# EAGLE design Ethernet_Breakout-Board (EAGLE 9.7.0)
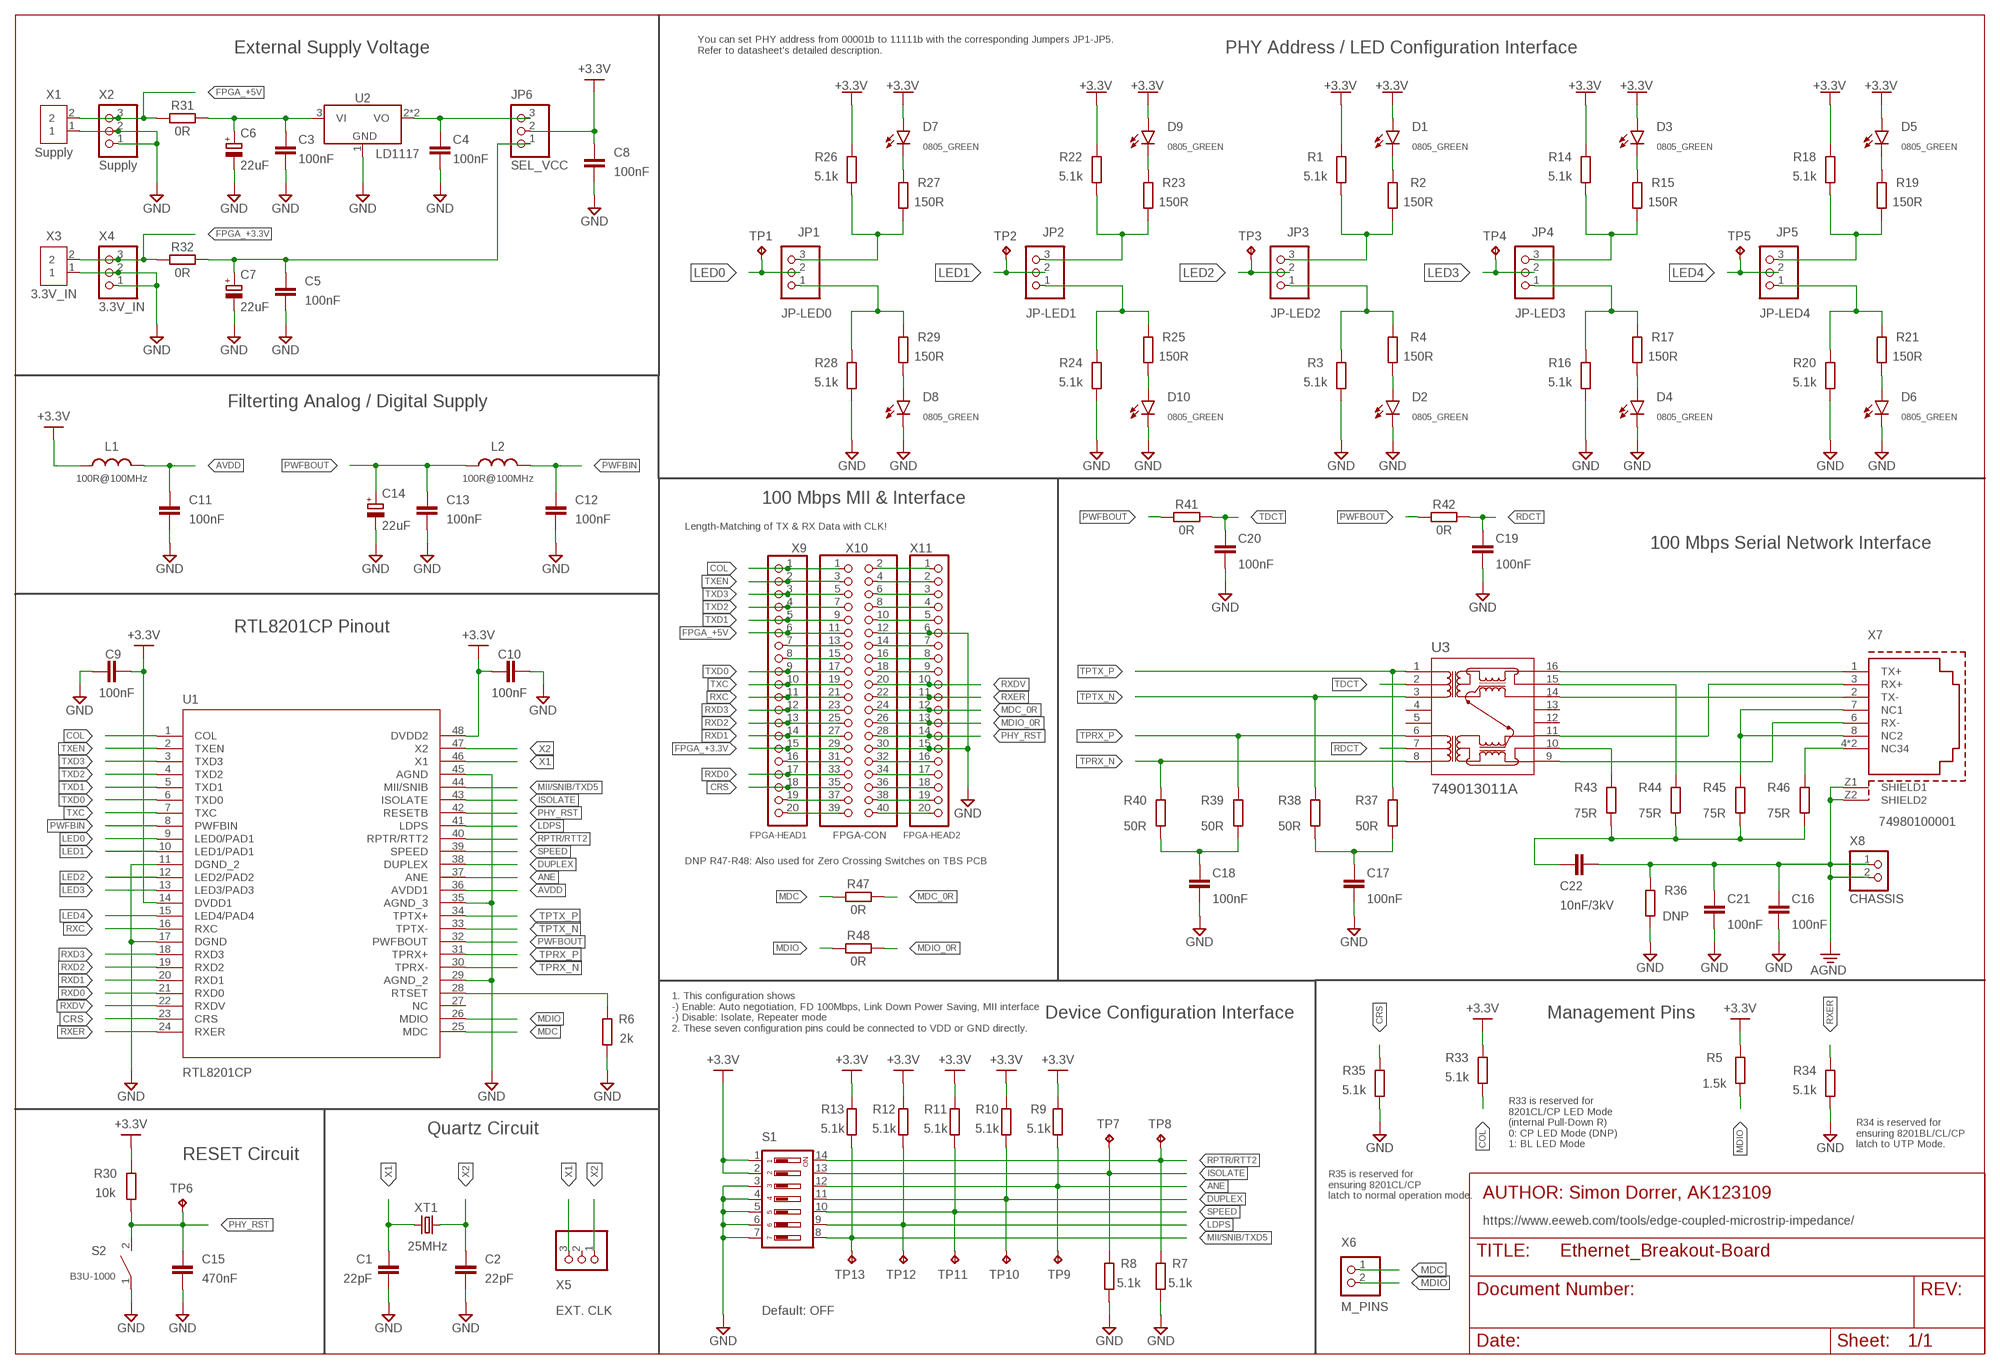
[diagram p0: schematic, sheet 1]

## Parts
C1  22pF  C_CHIP-0603(1608-METRIC)  [CAPC1608X85]
C2  22pF  C_CHIP-0603(1608-METRIC)  [CAPC1608X85]
C3  100nF  C_CHIP-0805(2012-METRIC)  [CAPC2012X110]
C4  100nF  C_CHIP-0805(2012-METRIC)  [CAPC2012X110]
C5  100nF  C_CHIP-0805(2012-METRIC)  [CAPC2012X110]
C6  22uF  C-POL_TANTALUM-1411(3528-METRIC)  [CAPMP3528X210N]
C7  22uF  C-POL_TANTALUM-1411(3528-METRIC)  [CAPMP3528X210N]
C8  100nF  C_CHIP-0805(2012-METRIC)  [CAPC2012X110]
C9  100nF  C_CHIP-0603(1608-METRIC)  [CAPC1608X85]
C10  100nF  C_CHIP-0603(1608-METRIC)  [CAPC1608X85]
C11  100nF  C_CHIP-0603(1608-METRIC)  [CAPC1608X85]
C12  100nF  C_CHIP-0603(1608-METRIC)  [CAPC1608X85]
C13  100nF  C_CHIP-0603(1608-METRIC)  [CAPC1608X85]
C14  22uF  C-POL_TANTALUM-1411(3528-METRIC)  [CAPMP3528X210N]
C15  470nF  C_CHIP-0805(2012-METRIC)  [CAPC2012X110]
C16  100nF  C_CHIP-0805(2012-METRIC)  [CAPC2012X110]
C17  100nF  C_CHIP-0805(2012-METRIC)  [CAPC2012X110]
C18  100nF  C_CHIP-0805(2012-METRIC)  [CAPC2012X110]
C19  100nF  C_CHIP-0805(2012-METRIC)  [CAPC2012X110]
C20  100nF  C_CHIP-0805(2012-METRIC)  [CAPC2012X110]
C21  100nF  C_CHIP-0805(2012-METRIC)  [CAPC2012X110]
C22  10nF/3kV  C-EU050-025X075  [C050-025X075]
D1  0805_GREEN  CHIP-FLAT-G_0805  [LEDC2012X110N_FLAT-G]
D2  0805_GREEN  CHIP-FLAT-G_0805  [LEDC2012X110N_FLAT-G]
D3  0805_GREEN  CHIP-FLAT-G_0805  [LEDC2012X110N_FLAT-G]
D4  0805_GREEN  CHIP-FLAT-G_0805  [LEDC2012X110N_FLAT-G]
D5  0805_GREEN  CHIP-FLAT-G_0805  [LEDC2012X110N_FLAT-G]
D6  0805_GREEN  CHIP-FLAT-G_0805  [LEDC2012X110N_FLAT-G]
D7  0805_GREEN  CHIP-FLAT-G_0805  [LEDC2012X110N_FLAT-G]
D8  0805_GREEN  CHIP-FLAT-G_0805  [LEDC2012X110N_FLAT-G]
D9  0805_GREEN  CHIP-FLAT-G_0805  [LEDC2012X110N_FLAT-G]
D10  0805_GREEN  CHIP-FLAT-G_0805  [LEDC2012X110N_FLAT-G]
JP1  JP-LED0  PINHD-1X3  [1X03]
JP2  JP-LED1  PINHD-1X3  [1X03]
JP3  JP-LED2  PINHD-1X3  [1X03]
JP4  JP-LED3  PINHD-1X3  [1X03]
JP5  JP-LED4  PINHD-1X3  [1X03]
JP6  SEL_VCC  PINHD-1X3  [1X03]
L1  100R@100MHz  L_CHIP-0603(1608-METRIC)  [INDC1608X95N]
L2  100R@100MHz  L_CHIP-0603(1608-METRIC)  [INDC1608X95N]
R1  5.1k  R_CHIP-0805(2012-METRIC)  [RESC2012X65]
R2  150R  R_CHIP-0805(2012-METRIC)  [RESC2012X65]
R3  5.1k  R_CHIP-0805(2012-METRIC)  [RESC2012X65]
R4  150R  R_CHIP-0805(2012-METRIC)  [RESC2012X65]
R5  1.5k  R_CHIP-0603(1608-METRIC)  [RESC1608X60]
R6  2k  R_CHIP-0603(1608-METRIC)  [RESC1608X60]
R7  5.1k  R_CHIP-0603(1608-METRIC)  [RESC1608X60]
R8  5.1k  R_CHIP-0603(1608-METRIC)  [RESC1608X60]
R9  5.1k  R_CHIP-0603(1608-METRIC)  [RESC1608X60]
R10  5.1k  R_CHIP-0603(1608-METRIC)  [RESC1608X60]
R11  5.1k  R_CHIP-0603(1608-METRIC)  [RESC1608X60]
R12  5.1k  R_CHIP-0603(1608-METRIC)  [RESC1608X60]
R13  5.1k  R_CHIP-0603(1608-METRIC)  [RESC1608X60]
R14  5.1k  R_CHIP-0805(2012-METRIC)  [RESC2012X65]
R15  150R  R_CHIP-0805(2012-METRIC)  [RESC2012X65]
R16  5.1k  R_CHIP-0805(2012-METRIC)  [RESC2012X65]
R17  150R  R_CHIP-0805(2012-METRIC)  [RESC2012X65]
R18  5.1k  R_CHIP-0805(2012-METRIC)  [RESC2012X65]
R19  150R  R_CHIP-0805(2012-METRIC)  [RESC2012X65]
R20  5.1k  R_CHIP-0805(2012-METRIC)  [RESC2012X65]
R21  150R  R_CHIP-0805(2012-METRIC)  [RESC2012X65]
R22  5.1k  R_CHIP-0805(2012-METRIC)  [RESC2012X65]
R23  150R  R_CHIP-0805(2012-METRIC)  [RESC2012X65]
R24  5.1k  R_CHIP-0805(2012-METRIC)  [RESC2012X65]
R25  150R  R_CHIP-0805(2012-METRIC)  [RESC2012X65]
R26  5.1k  R_CHIP-0805(2012-METRIC)  [RESC2012X65]
R27  150R  R_CHIP-0805(2012-METRIC)  [RESC2012X65]
R28  5.1k  R_CHIP-0805(2012-METRIC)  [RESC2012X65]
R29  150R  R_CHIP-0805(2012-METRIC)  [RESC2012X65]
R30  10k  R_CHIP-0805(2012-METRIC)  [RESC2012X65]
R31  0R  R_CHIP-0805(2012-METRIC)  [RESC2012X65]
R32  0R  R_CHIP-0805(2012-METRIC)  [RESC2012X65]
R33  5.1k  R_CHIP-0603(1608-METRIC)  [RESC1608X60]
R34  5.1k  R_CHIP-0603(1608-METRIC)  [RESC1608X60]
R35  5.1k  R_CHIP-0603(1608-METRIC)  [RESC1608X60]
R36  DNP  R_CHIP-0805(2012-METRIC)  [RESC2012X65]
R37  50R  R_CHIP-0805(2012-METRIC)  [RESC2012X65]
R38  50R  R_CHIP-0805(2012-METRIC)  [RESC2012X65]
R39  50R  R_CHIP-0805(2012-METRIC)  [RESC2012X65]
R40  50R  R_CHIP-0805(2012-METRIC)  [RESC2012X65]
R41  0R  R_CHIP-0805(2012-METRIC)  [RESC2012X65]
R42  0R  R_CHIP-0805(2012-METRIC)  [RESC2012X65]
R43  75R  R_CHIP-0805(2012-METRIC)  [RESC2012X65]
R44  75R  R_CHIP-0805(2012-METRIC)  [RESC2012X65]
R45  75R  R_CHIP-0805(2012-METRIC)  [RESC2012X65]
R46  75R  R_CHIP-0805(2012-METRIC)  [RESC2012X65]
R47  0R  R_CHIP-0805(2012-METRIC)  [RESC2012X65]
R48  0R  R_CHIP-0805(2012-METRIC)  [RESC2012X65]
S1  DS07  [DS-07]
S2  B3U-1000  B3U-X000B3U-1000P(M)-B1000P(M)-B  [B3U-1000P(M)-B]
TP1  TPB1,27  [B1,27]
TP2  TPB1,27  [B1,27]
TP3  TPB1,27  [B1,27]
TP4  TPB1,27  [B1,27]
TP5  TPB1,27  [B1,27]
TP6  TPPAD1-13  [P1-13]
TP7  TPB1,27  [B1,27]
TP8  TPB1,27  [B1,27]
TP9  TPB1,27  [B1,27]
TP10  TPB1,27  [B1,27]
TP11  TPB1,27  [B1,27]
TP12  TPB1,27  [B1,27]
TP13  TPB1,27  [B1,27]
U1  RTL8201CP  RTL8201L  [LQFP48_7X7X1P4_RTK]
U2  LD1117  LD1117_SOT223  [SOT230P700X170-4]
U3  749013011A  749013011ALAN-TRANSFORMER_WE-LAN_POE_W00  [LAN-TRANSFORMER_WE-LAN_POE_W00]
X1  Supply  2828XX-2282837-2  [TERMBLK_508-2N]
X2  Supply  PINHD-1X3  [1X03]
X3  3.3V_IN  2828XX-2282837-2  [TERMBLK_508-2N]
X4  3.3V_IN  PINHD-1X3  [1X03]
X5  EXT. CLK  PINHD-1X3  [1X03]
X6  M_PINS  PINHD-1X2  [1X02]
X7  74980100001  WE-RJ45_74980100001  [74980100001]
X8  CHASSIS  PINHD-1X2  [1X02]
X9  FPGA-HEAD1  PINHD-1X20  [1X20]
X10  FPGA-CON  PINHD-2X20  [2X20]
X11  FPGA-HEAD2  PINHD-1X20  [1X20]
XT1  25MHz  CRYSTAL_HC49-11.5L-3.6H  [XTALRR488W43L1150T500H368B]

## Nets
+3.3V: C8.1 C9.2 C10.1 D1.A D3.A D5.A D7.A D9.A JP6.2 L1.1 R1.1 R5.1 R9.2 R10.2 R11.2 R12.2 R13.2 R14.1 R18.1 R22.1 R26.1 R30.2 R33.1 S1.1 S1.2 U1.14(DVDD1) U1.48(DVDD2)
AGND: C16.1 C21.1 C22.2 R36.2 X7.Z1(SHIELD1) X7.Z2(SHIELD2) X8.1 X8.2
ANE: R9.1 S1.12 TP9.TP U1.37(ANE)
AVDD: C11.1 L1.2 U1.36(AVDD1)
COL: R33.2 U1.1(COL) X9.1 X10.1
CRS: R35.1 U1.23(CRS) X9.18 X10.35
DUPLEX: R10.1 S1.11 TP10.TP U1.38(DUPLEX)
FPGA_+3.3V: R32.2 X3.2 X4.3 X9.15 X10.29
FPGA_+5V: R31.2 X1.2 X2.3 X9.6 X10.11
GND: C1.2 C2.2 C3.2 C4.2 C5.2 C6.2(-) C7.2(-) C8.2 C9.1 C10.2 C11.2 C12.2 C13.2 C14.2(-) C15.2 C16.2 C17.2 C18.2 C19.2 C20.2 C21.2 D2.C D4.C D6.C D8.C D10.C R3.1 R6.1 R7.1 R8.1 R16.1 R20.1 R24.1 R28.1 R34.2 R35.2 R36.1 S1.3 S1.4 S1.5 S1.6 S1.7 S2.1 U1.11(DGND_2) U1.17(DGND) U1.29(AGND_2) U1.35(AGND_3) U1.45(AGND) U2.1(GND) X1.1 X2.1 X2.2 X3.1 X4.1 X4.2 X10.12 X10.30 X11.6 X11.15
ISOLATE: R8.2 S1.13 TP7.TP U1.43(ISOLATE)
LDPS: R12.1 S1.9 TP12.TP U1.41(LDPS)
LED0: JP1.2 TP1.TP U1.9(LED0/PAD1)
LED1: JP2.2 TP2.TP U1.10(LED1/PAD1)
LED2: JP3.2 TP3.TP U1.12(LED2/PAD2)
LED3: JP4.2 TP4.TP U1.13(LED3/PAD3)
LED4: JP5.2 TP5.TP U1.15(LED4/PAD4)
MDC: R47.2 U1.25(MDC) X6.1
MDC_0R: R47.1 X10.24 X11.12
MDIO: R5.2 R48.2 U1.26(MDIO) X6.2
MDIO_0R: R48.1 X10.26 X11.13
MII/SNIB/TXD5: R13.1 S1.8 TP13.TP U1.44(MII/SNIB)
N$1: R6.2 U1.28(RTSET)
N$2: D1.C R2.1
N$3: JP3.3 R1.2 R2.2
N$4: D2.A R4.1
N$5: JP3.1 R3.2 R4.2
N$6: C5.1 C7.1(+) JP6.1 R32.1
N$7: X10.32 X11.16
N$8: D3.C R15.1
N$9: JP4.3 R14.2 R15.2
N$10: D4.A R17.1
N$11: JP4.1 R16.2 R17.2
N$12: D5.C R19.1
N$13: JP5.3 R18.2 R19.2
N$14: D6.A R21.1
N$15: JP5.1 R20.2 R21.2
N$16: D9.C R23.1
N$17: JP2.3 R22.2 R23.2
N$18: JP2.1 R24.2 R25.2
N$19: D10.A R25.1
N$20: D7.C R27.1
N$21: JP1.3 R26.2 R27.2
N$22: D8.A R29.1
N$23: JP1.1 R28.2 R29.2
N$24: C3.1 C6.1(+) R31.1 U2.3(VI)
N$25: C4.1 JP6.3 U2.2(VO) U2.4(VO)
N$26: X10.34 X11.17
N$27: X10.36 X11.18
N$28: X10.38 X11.19
N$29: X10.40 X11.20
N$31: R46.2 X7.4(NC34) X7.5(NC34)
N$32: C17.1 R37.1 R38.1
N$33: C18.1 R39.1 R40.1
N$34: R43.2 U3.10
N$35: R44.2 U3.15
N$36: R45.2 X7.7(NC1) X7.8(NC2)
N$37: C22.1 R43.1 R44.1 R45.1 R46.1
N$44: X9.7 X10.13
N$45: X9.8 X10.15
N$53: X9.16 X10.31
N$56: X9.19 X10.37
N$57: X9.20 X10.39
N$58: X10.2 X11.1
N$59: X10.4 X11.2
N$60: X10.6 X11.3
N$61: X10.8 X11.4
N$62: X10.10 X11.5
N$64: X10.14 X11.7
N$65: X10.16 X11.8
N$66: X10.18 X11.9
PHY_RST: C15.1 R30.1 S2.2 TP6.TP U1.42(RESETB) X10.28 X11.14
PWFBIN: C12.1 L2.2 U1.8(PWFBIN)
PWFBOUT: C13.1 C14.1(+) L2.1 R41.2 R42.2 U1.32(PWFBOUT)
RDCT: C19.1 R42.1 U3.7
RPTR/RTT2: R7.2 S1.14 TP8.TP U1.40(RPTR/RTT2)
RX_N: U3.9 X7.6(RX-)
RX_P: U3.11 X7.3(RX+)
RXC: U1.16(RXC) X9.11 X10.21
RXD0: U1.21(RXD0) X9.17 X10.33
RXD1: U1.20(RXD1) X9.14 X10.27
RXD2: U1.19(RXD2) X9.13 X10.25
RXD3: U1.18(RXD3) X9.12 X10.23
RXDV: U1.22(RXDV) X10.20 X11.10
RXER: R34.1 U1.24(RXER) X10.22 X11.11
SPEED: R11.1 S1.10 TP11.TP U1.39(SPEED)
TDCT: C20.1 R41.1 U3.2
TPRX_N: R40.2 U1.30(TPRX-) U3.8
TPRX_P: R39.2 U1.31(TPRX+) U3.6
TPTX_N: R38.2 U1.33(TPTX-) U3.3
TPTX_P: R37.2 U1.34(TPTX+) U3.1
TX_N: U3.14 X7.2(TX-)
TX_P: U3.16 X7.1(TX+)
TXC: U1.7(TXC) X9.10 X10.19
TXD0: U1.6(TXD0) X9.9 X10.17
TXD1: U1.5(TXD1) X9.5 X10.9
TXD2: U1.4(TXD2) X9.4 X10.7
TXD3: U1.3(TXD3) X9.3 X10.5
TXEN: U1.2(TXEN) X9.2 X10.3
X1: C1.1 U1.46(X1) X5.3 XT1.1
X2: C2.1 U1.47(X2) X5.1 XT1.2
Unconnected: U1.27(NC) U3.4 U3.5 U3.12 U3.13 X5.2

## Notes on the sheet
- External Supply Voltage
- You can set PHY address from 00001b to 11111b with the corresponding Jumpers JP1-JP5.
  Refer to datasheet's detailed description.
- PHY Address / LED Configuration Interface
- Filterting Analog / Digital Supply
- 100 Mbps MII & Interface
- Length-Matching of TX & RX Data with CLK!
- 100 Mbps Serial Network Interface
- RTL8201CP Pinout
- DNP R47-R48: Also used for Zero Crossing Switches on TBS PCB
- Device Configuration Interface | Management Pins
- 1. This configuration shows
  -) Enable: Auto negotiation, FD 100Mbps, Link Down Power Saving, MII interface
  -) Disable: Isolate, Repeater mode
  2. These seven configuration pins could be connected to VDD or GND directly.
- Quartz Circuit
- R33 is reserved for
  8201CL/CP LED Mode
  (internal Pull-Down R)
  0: CP LED Mode (DNP)
  1: BL LED Mode
- R34 is reserved for
  ensuring 8201BL/CL/CP
  latch to UTP Mode.
- RESET Circuit
- R35 is reserved for
  ensuring 8201CL/CP
  latch to normal operation mode.
- AUTHOR: Simon Dorrer, AK123109
- https://www.eeweb.com/tools/edge-coupled-microstrip-impedance/
- Default: OFF

## Library data of the parts
C1-C5 C8-C13 C15-C21 = Capacitor:C: Capacitor - Generic; CATEGORY: Capacitor
C6 C7 C14 = Capacitor:C-POL: Capacitor Polarised - Generic; CATEGORY: Capacitor
C22 = rcl:C-EU: CAPACITOR, European symbol; SPICEPREFIX: C
D1-D10 = LED:CHIP-FLAT-G; CATEGORY: LED; COLOR: GREEN; DESCRIPTION: CHIP LED FLAT; SUB-CATEGORY: CHIP; TYPE: FLAT_TOP; VALUE: LED_GREEN
JP1-JP6 X2 X4 X5 = Connector:PINHD-1X3: PIN HEADER; CATEGORY: CONNECTOR; SUB-CATEGORY: PIN-HEADER
L1 L2 = Inductor:L: Inductor Fixed - Generic; CATEGORY: Inductor; SUB-CATEGORY: Fixed
R1-R48 = Resistor:R: Resistor Fixed - Generic; CATEGORY: Resistor; SUB-CATEGORY: Fixed
S1 = Switch:DS07: DIL/CODE SWITCH; CATEGORY: SWITCH; MPN: MCNDS-07-V; TYPE: SPST
S2 = Switch:B3U-X000: Ultra-small Tactile Switch Contact form : SPST-NO Datasheet <https://omronfs.omron.com/en_US/ecb/products/pdf/en-b3u.pdf>; CATEGORY: SWITCH; DESCRIPTION: Ultra-small Surface-mounting Tactile Switches with High Contact Reliability; MANUFACTURER: OMRON; OPERATING_TEMPERATURE: -25°C to +70°C at 60%RH max; PART_STATUS: ACTIVE; SERIES: B3U; TYPE: Tactile; VALUE: B3U-1000P(M)-B
TP1-TP13 = testpad:TP: Test pad
U1 = RTL8201L:RTL8201L; COPYRIGHT: Copyright (C) 2023 Ultra Librarian. All rights reserved.; MANUFACTURER_PART_NUMBER: RTL8201L; MFR_NAME: Realtek
U2 = LM1117:LD1117: Adjustable and fixed positive voltage regulator Reference Datasheet <https://www.st.com/content/ccc/resource/technical/document/datasheet/99/3b/7d/91/91/51/4b/be/CD00000544.pdf/files/CD00000544.pdf/jcr:content/translations/en.CD00000544.pdf>; CATEGORY: IC_Linear; DESCRIPTION: Adjustable voltage regulator; MANUFACTURER: STMicroelectronics; MPN: Generic; SERIES: LM1117; SUB-CATEGORY: Voltage Regulator; TYPE: Linear
U3 = 749013011A:749013011A; COPYRIGHT: Copyright (C) 2023 Ultra Librarian. All rights reserved.; MANUFACTURER_PART_NUMBER: 749013011A; MFR_NAME: Wurth Electronics
X1 X3 = Connector:2828XX-2: 2 Position Wire to Board Terminal Block Horizontal with Board Datasheet <https://www.te.com.cn/commerce/DocumentDelivery/DDEController?Action=showdoc&DocId=Catalog+Section%7F1308389_EUROSTYLE_TERMINAL_BLOCKS%7F0607%7Fpdf%7FEnglish%7FENG_CS_1308389_EUROSTYLE_TERMINAL_BLOCKS_0607.pdf%7F2-282837-5>; CATEGORY: Connector; DESCRIPTION: 2 Position Wire to Board Terminal Block Horizontal with Board 5.08 mm Through Hole; MANUFACTURER: TE Connectivity; MPN: 282837-2; OPERATING_TEMPERATURE: -40°C to +105°C; PART_STATUS: ACTIVE; ROHS_COMPLIANCE: RoHS Compliant; SERIES: 282837; SUBCATEGORY: Terminal Block; TYPE: Side Wire Entry
X6 X8 = Connector:PINHD-1X2: PIN HEADER; CATEGORY: CONNECTOR; SUB-CATEGORY: PIN-HEADER
X7 = Wurth_Signal & Communications_WE-RJ45_LAN:WE-RJ45_74980100001: WE-RJ45 LAN Through Hole Reflow Characteristics RJ45 designed to use for Pin-in-Paste soldering High mechanical stability through THT pins High Temperature LEDs Extra high standoff for a good thermal airflow Power over Ethernet up to 30 W Compliant with standard: IEEE 802.3u, IEEE 802.3ab, IEEE 802.3af, IEEE 802.3at Applications Suitable for industrial temperatures from –40 °C up to +85 °C Compatible to Industrial Ethernet systems like EtherCAT or Profinet Compliant with most IC’s for Ethernet applications such as Microchip, Texas Instruments, Broadcom, Linear Technology Hubs, Routers, Switches, IP cameras, IoT applications <https://www.we-online.com/components/media/o713596v209%20family-we-rj45-74980111212.jpg> Details see: www.we-online.com/components/products/WE-LAN-RJ45_THR Created by Ella Wu 2022-12-16 2022 (C) Wurth Elektronik; DATA-RATE: 10/100BASE-T; DATASHEET-URL: https://www.we-online.com/redexpert/spec/74980100001?ae; LED: -; MOUNT: THT; PART-NUMBER: 74980100001; POE: non-PoE; PORTS: 1; USB: No
X9 X11 = Connector:PINHD-1X20: PIN HEADER; CATEGORY: CONNECTOR; SUB-CATEGORY: PIN-HEADER
X10 = Connector:PINHD-2X20: PIN HEADER; CATEGORY: CONNECTOR; SUB-CATEGORY: PIN-HEADER
XT1 = Frequency-Source:CRYSTAL: Crystal 2Pin - Generic; CATEGORY: Frequency-Source; SUB-CATEGORY: Crystal-2Pin; VALUE: HC49

## Board
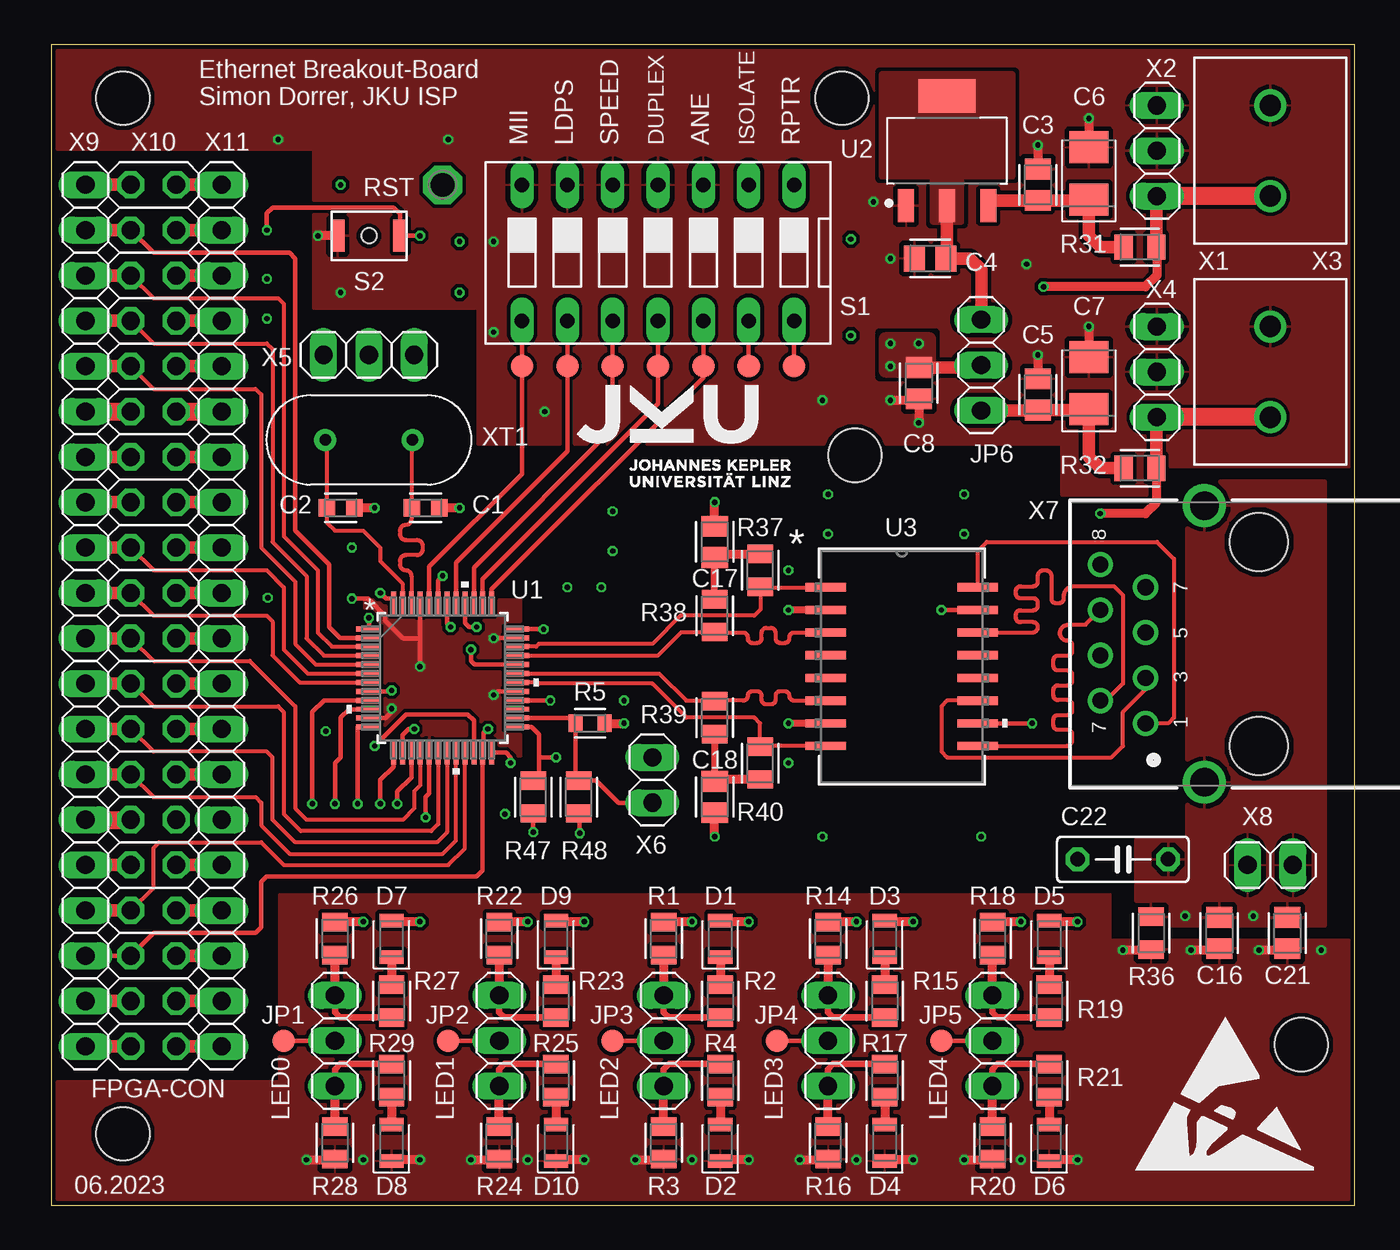
[diagram p1: board, top side]
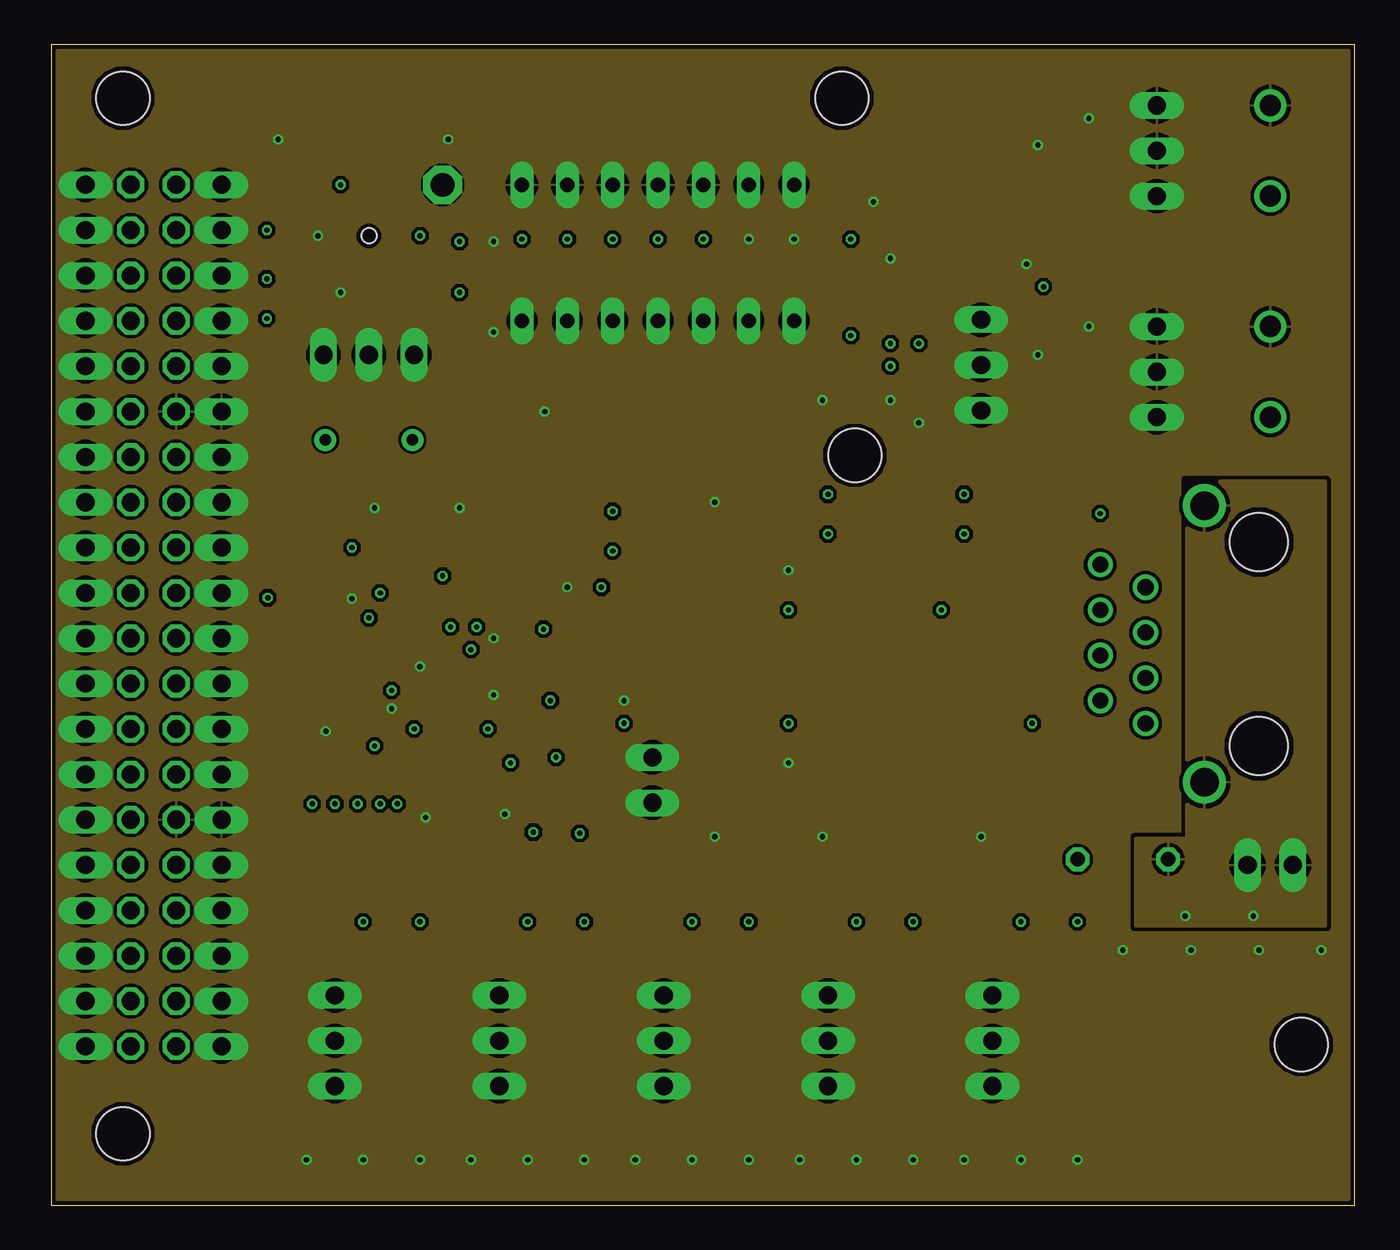
[diagram p2: board, inner layer Route2]
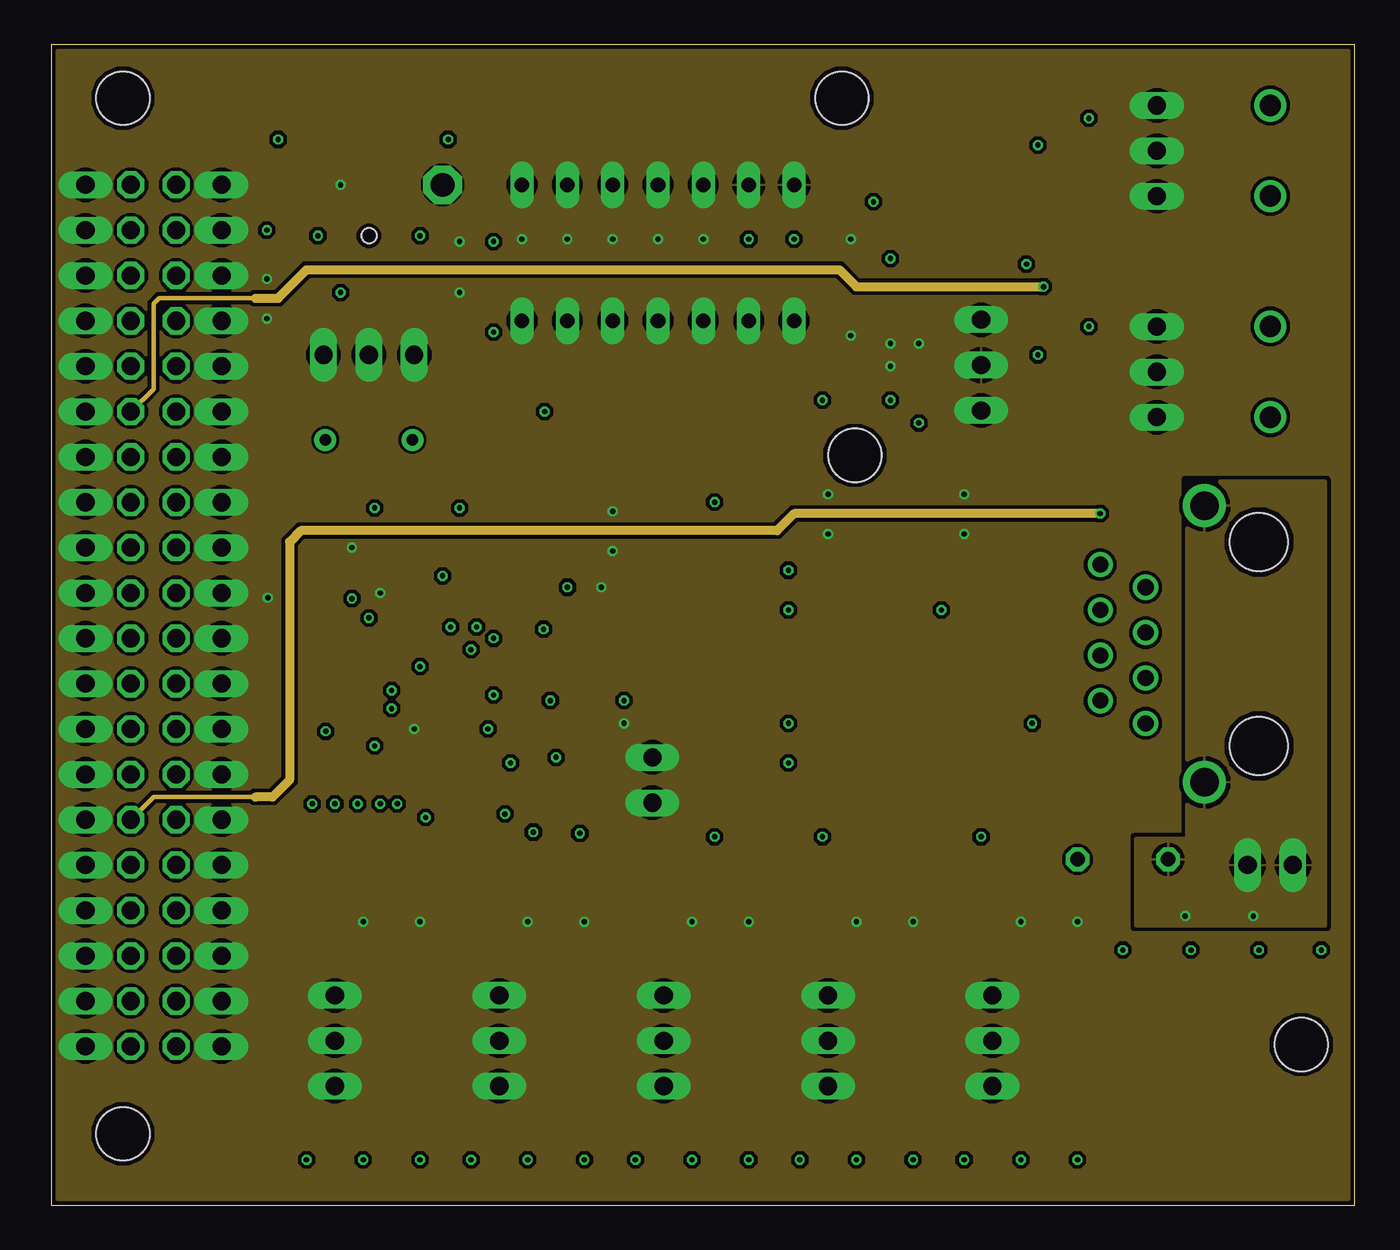
[diagram p3: board, inner layer Route15]
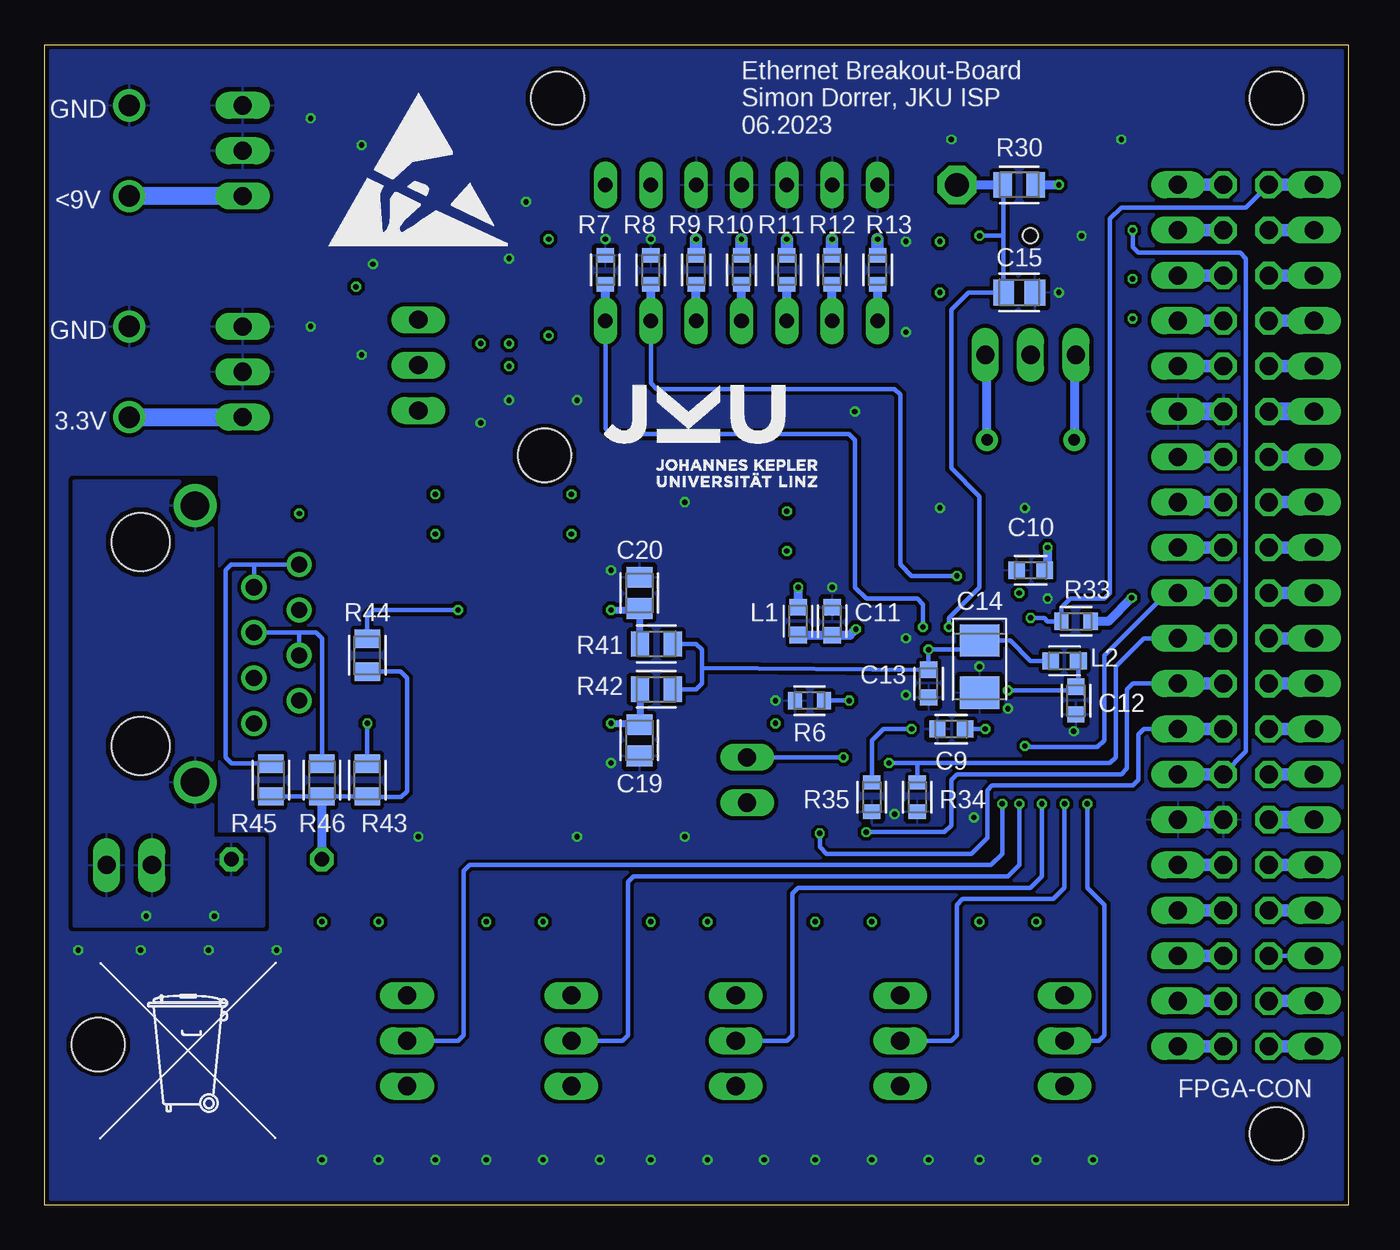
[diagram p4: board, bottom side, seen from below]

Size 73 x 65 mm. Coordinates in mm from the lower left corner, seen from the top.
Outline: 0,0 73,0 73,65 0,65 0,0
Copper layers (1+2*15+16): Top / Route2 / Route15 / Bottom
Stack-up 4 Layer Stack: Top SilkScreen Epoxy Ink / Top SolderMask SR:Green 0.0254mm Dk 4.3 / Top Surface Finish Lead-Free 0.02mm / Top CuFoil:007 0.035mm / Dielectric-1 Prepreg:088 0.1mm / Route2 CuFoil:004 0.015mm / Dielectric-3 Core:087 1.06mm / Route15 CuFoil:004 0.015mm / Dielectric-5 Prepreg:088 0.1mm / Bottom CuFoil:007 0.035mm / Bottom Surface Finish Lead-Free 0.02mm / Bottom SolderMask SR:Green 0.0254mm Dk 4.3 / Bottom SilkScreen Epoxy Ink
Design rules: minimum copper width 5mil, minimum drill size 0.25mm, copper clearance wire_polygon to pad_smd 0.2mm, copper clearance wire_polygon to via 0.2mm, copper clearance wire_polygon to wire_polygon 5mil, copper clearance pad_smd to pad_smd 5mil, copper clearance pad_smd to via 5mil, copper clearance via to via 5mil, copper clearance smd to pad (same net) 5mil, copper clearance smd to via (same net) 5mil, copper clearance smd to smd (same net) 5mil, dimension clearance 10mil, via restrict clearance 0mil, restrict clearance 0mil, drill distance 10mil, keepout clearance 0mil
Holes 3 mm at 4,62 4,4 45,42 44.27,62 70,9

### Footprints (pad centres in the part's own frame; a part is rotated, then mirrored left to right if it is on the bottom)
CAPC1608X85 = smd 0.921 x 0.97: 1 -0.775,0; 2 0.775,0
CAPC2012X110 = smd 1.165 x 1.465: 1 -0.875,0; 2 0.875,0
CAPMP3528X210N = smd 1.796 x 2.204: 1 -1.46,0; 2 1.46,0
C050-025X075 = drill 0.813 octagon: 1 -2.54,0; 2 2.54,0
LEDC2012X110N_FLAT-G = smd 0.762 x 1.362: A 1.025,0; C -1.025,0
1X03 = drill 1.016 long: 1 -2.54,0; 2 0,0; 3 2.54,0
INDC1608X95N = smd 0.9 x 0.97: 1 -0.785,0 | smd 0.933 x 0.97: 2 0.769,0
RESC2012X65 = smd 1.031 x 1.42: 1 -0.919,0; 2 0.919,0
RESC1608X60 = smd 0.799 x 0.974: 1 -0.815,0; 2 0.815,0
DS-07 = drill 0.813 long: 1 -7.62,-3.81; 2 -5.08,-3.81; 3 -2.54,-3.81; 4 0,-3.81; 5 2.54,-3.81; 6 5.08,-3.81; 7 7.62,-3.81; 8 7.62,3.81; 9 5.08,3.81; 10 2.54,3.81; 11 0,3.81; 12 -2.54,3.81; 13 -5.08,3.81; 14 -7.62,3.81
B3U-1000P(M)-B = smd 0.8 x 1.8: 1 -1.75,0; 2 1.75,0 | hole 0.85: 0,0
B1,27 = smd 1.27 x 1.27: TP 0,0
P1-13 = drill 1.321 pad 2.159 octagon: TP 0,0
LQFP48_7X7X1P4_RTK = smd 1.346 x 0.279: 1 -4.178,2.75; 2 -4.178,2.25; 3 -4.178,1.75; 4 -4.178,1.25; 5 -4.178,0.75; 6 -4.178,0.25; 7 -4.178,-0.25; 8 -4.178,-0.75; 9 -4.178,-1.25; 10 -4.178,-1.75; 11 -4.178,-2.25; 12 -4.178,-2.75; 25 4.178,-2.75; 26 4.178,-2.25; 27 4.178,-1.75; 28 4.178,-1.25; 29 4.178,-0.75; 30 4.178,-0.25; 31 4.178,0.25; 32 4.178,0.75; 33 4.178,1.25; 34 4.178,1.75; 35 4.178,2.25; 36 4.178,2.75 | smd 0.279 x 1.346: 13 -2.75,-4.178; 14 -2.25,-4.178; 15 -1.75,-4.178; 16 -1.25,-4.178; 17 -0.75,-4.178; 18 -0.25,-4.178; 19 0.25,-4.178; 20 0.75,-4.178; 21 1.25,-4.178; 22 1.75,-4.178; 23 2.25,-4.178; 24 2.75,-4.178; 37 2.75,4.178; 38 2.25,4.178; 39 1.75,4.178; 40 1.25,4.178; 41 0.75,4.178; 42 0.25,4.178; 43 -0.25,4.178; 44 -0.75,4.178; 45 -1.25,4.178; 46 -1.75,4.178; 47 -2.25,4.178; 48 -2.75,4.178
SOT230P700X170-4 = smd 1.86 x 0.898: 1 -3.075,2.3; 2 -3.075,0; 3 -3.075,-2.3 | smd 1.86 x 3.189: 4 3.075,0
LAN-TRANSFORMER_WE-LAN_POE_W00 = smd 2.261 x 0.457: 1 -4.255,4.445; 2 -4.255,3.175; 3 -4.255,1.905; 4 -4.255,0.635; 5 -4.255,-0.635; 6 -4.255,-1.905; 7 -4.255,-3.175; 8 -4.255,-4.445; 9 4.255,-4.445; 10 4.255,-3.175; 11 4.255,-1.905; 12 4.255,-0.635; 13 4.255,0.635; 14 4.255,1.905; 15 4.255,3.175; 16 4.255,4.445
TERMBLK_508-2N = drill 1.2: 1 0,0; 2 5.08,0
1X02 = drill 1.016 long: 1 -1.27,0; 2 1.27,0
74980100001 = drill 0.9: 1 -4.445,6.35; 2 -3.175,8.89; 3 -1.905,6.35; 4 -0.635,8.89; 5 0.635,6.35; 6 1.905,8.89; 7 3.175,6.35; 8 4.445,8.89 | drill 1.6: Z1 7.745,3.05; Z2 -7.745,3.05 | hole 3.25: 5.715,0; -5.715,0
1X20 = drill 1.016 long: 1 -24.13,0; 2 -21.59,0; 3 -19.05,0; 4 -16.51,0; 5 -13.97,0; 6 -11.43,0; 7 -8.89,0; 8 -6.35,0; 9 -3.81,0; 10 -1.27,0; 11 1.27,0; 12 3.81,0; 13 6.35,0; 14 8.89,0; 15 11.43,0; 16 13.97,0; 17 16.51,0; 18 19.05,0; 19 21.59,0; 20 24.13,0
2X20 = drill 1.016 octagon: 1 -24.13,-1.27; 2 -24.13,1.27; 3 -21.59,-1.27; 4 -21.59,1.27; 5 -19.05,-1.27; 6 -19.05,1.27; 7 -16.51,-1.27; 8 -16.51,1.27; 9 -13.97,-1.27; 10 -13.97,1.27; 11 -11.43,-1.27; 12 -11.43,1.27; 13 -8.89,-1.27; 14 -8.89,1.27; 15 -6.35,-1.27; 16 -6.35,1.27; 17 -3.81,-1.27; 18 -3.81,1.27; 19 -1.27,-1.27; 20 -1.27,1.27; 21 1.27,-1.27; 22 1.27,1.27; 23 3.81,-1.27; 24 3.81,1.27; 25 6.35,-1.27; 26 6.35,1.27; 27 8.89,-1.27; 28 8.89,1.27; 29 11.43,-1.27; 30 11.43,1.27; 31 13.97,-1.27; 32 13.97,1.27; 33 16.51,-1.27; 34 16.51,1.27; 35 19.05,-1.27; 36 19.05,1.27; 37 21.59,-1.27; 38 21.59,1.27; 39 24.13,-1.27; 40 24.13,1.27
XTALRR488W43L1150T500H368B = drill 0.63 pad 1.23: 1 -2.44,0; 2 2.44,0

### Placement (x,y rotation side)
C1  20.95,39.05 0 top
C2  16.19,39.05 0 top
C3  55.24,57.15 90 top
C4  49.21,53.02 180 top
C5  55.24,45.4 90 top
C6  58.1,57.78 90 top
C7  58.1,46.04 90 top
C8  48.58,46.04 270 top
C9  22.23,26.67 0 bottom
C10  17.78,35.56 180 bottom
C11  28.89,32.7 90 bottom
C12  15.24,28.26 270 bottom
C13  23.5,29.21 270 bottom
C14  20.64,30.16 270 bottom
C15  18.41,51.12 0 bottom
C16  65.41,15.24 270 top
C17  37.15,37.15 90 top
C18  37.15,22.86 270 top
C19  39.69,26.04 270 bottom
C20  39.69,34.29 90 bottom
C21  69.22,15.24 270 top
C22  60.01,19.37 0 top
D1  37.47,14.92 90 top
D2  37.47,3.49 90 top
D3  46.67,14.92 90 top
D4  46.67,3.49 90 top
D5  55.88,14.92 90 top
D6  55.88,3.49 90 top
D7  19.05,14.92 90 top
D8  19.05,3.49 90 top
D9  28.26,14.92 90 top
D10  28.26,3.49 90 top
JP1  15.88,9.21 90 top
JP2  25.08,9.21 90 top
JP3  34.29,9.21 90 top
JP4  43.5,9.21 90 top
JP5  52.7,9.21 90 top
JP6  52.07,47.05 90 top
L1  30.8,32.7 270 bottom
L2  15.88,30.48 0 bottom
R1  34.29,14.92 270 top
R2  37.47,11.43 270 top
R3  34.29,3.49 90 top
R4  37.47,6.99 90 top
R5  30.16,26.99 180 top
R6  30.16,28.26 0 bottom
R7  41.59,52.39 270 bottom
R8  39.05,52.39 270 bottom
R9  36.51,52.39 90 bottom
R10  33.97,52.39 90 bottom
R11  31.43,52.39 90 bottom
R12  28.89,52.39 90 bottom
R13  26.35,52.39 90 bottom
R14  43.5,14.92 270 top
R15  46.67,11.43 270 top
R16  43.5,3.49 90 top
R17  46.67,6.99 90 top
R18  52.7,14.92 270 top
R19  55.88,11.43 270 top
R20  52.7,3.49 90 top
R21  55.88,6.99 90 top
R22  25.08,14.92 270 top
R23  28.26,11.43 270 top
R24  25.08,3.49 90 top
R25  28.26,6.99 90 top
R26  15.88,14.92 270 top
R27  19.05,11.43 270 top
R28  15.88,3.49 90 top
R29  19.05,6.99 90 top
R30  18.41,57.15 0 bottom
R31  60.96,53.66 0 top
R32  60.96,41.27 0 top
R33  15.24,32.7 180 bottom
R34  24.13,22.86 270 bottom
R35  26.67,22.86 270 bottom
R36  61.59,15.24 90 top
R37  39.69,35.56 270 top
R38  37.15,33.02 270 top
R39  37.15,27.3 90 top
R40  39.69,24.77 90 top
R41  38.73,31.43 0 bottom
R42  38.73,28.89 0 bottom
R43  54.93,23.81 90 bottom
R44  54.93,30.8 90 bottom
R45  60.33,23.81 90 bottom
R46  57.47,23.81 90 bottom
R47  26.99,22.86 90 top
R48  29.53,22.86 90 top
S1  33.97,53.34 180 top
S2  17.78,54.29 0 top
TP1  13.02,9.21 0 top
TP2  22.23,9.21 0 top
TP3  31.43,9.21 0 top
TP4  40.64,9.21 0 top
TP5  49.85,9.21 0 top
TP6  21.91,57.15 0 top
TP7  39.05,46.99 0 top
TP8  41.59,46.99 0 top
TP9  36.51,46.99 0 top
TP10  33.97,46.99 0 top
TP11  31.43,46.99 0 top
TP12  28.89,46.99 0 top
TP13  26.35,46.99 0 top
U1  21.91,29.53 0 top
U2  50.16,59.05 90 top
U3  47.62,30.16 0 top
U$1  [ESD_10.00]  60.64,1.91 0 top
U$2  [TONNE_10.00]  65.09,6.67 0 bottom
U$3  [ESD_10.00]  57.15,53.66 0 bottom
X1  68.26,61.59 270 top
X2  61.91,59.05 270 top
X3  68.26,49.21 270 top
X4  61.91,46.67 270 top
X5  17.78,47.62 0 top
X6  33.66,23.81 270 top
X7  67.63,31.43 90 top
X8  68.26,19.05 0 top
X9  1.91,33.02 270 top
X10  5.71,33.02 270 top
X11  9.53,33.02 270 top
XT1  17.78,42.86 180 top

### Tracks (layer width: path | path; a pad name or v marks a point on that pad's centre or on a via)
+3.3V  (via drill 0.3 pad 0.5)
  Top 0.254: U1.14 19.66,26.32 20,26.67 v20.32,26.67 | v18.41,34.29 18.73,33.97 19.16,33.97 U1.48
  Top 0.5: v26.67,15.88 25.12,15.88 R22.1 | v29.84,15.88 28.33,15.88 D9.A | v20.64,15.88 19.12,15.88 D7.A | v35.88,15.88 34.32,15.88 R1.1 | v39.05,15.88 37.54,15.88 D1.A | v45.09,15.88 43.53,15.88 R14.1 | v48.26,15.88 46.74,15.88 D3.A | v54.29,15.88 52.74,15.88 R18.1 | v57.47,15.88 55.95,15.88 D5.A | R5.1 v32.07,26.99 | v17.46,15.88 15.91,15.88 R26.1
  Top 0.7: C8.1 51.93,46.91 JP6.2
  Bottom 0.254: v20.32,26.67 C9.2
  Bottom 0.5: v16.83,36.83 16.83,35.64 C10.1 | v12.11,34.02 13.43,32.7 R33.1 | R30.2 v16.19,57.15 | v30.8,34.61 L1.1
  Bottom 0.7: v26.35,54.1 R13.2 | v28.89,54.1 R12.2 | v31.43,54.1 R11.2 | v33.97,54.1 R10.2 | v36.51,54.1 R9.2
  other vias: 46.99,46.99 46.99,48.26 48.58,48.26 22.86,51.12 44.77,48.7 43.5,37.59 51.12,37.59 43.5,39.81 51.12,39.81 31.43,38.86 31.43,36.64 44.77,54.1 22.86,53.98 12.06,51.88 12.06,49.66
  pour Route15 (isolate 0.2, rank 2): 0,0 0,65 73,65 73,0
  pour Top (isolate 0.3, no thermals): 46.35,48.9 46.35,46.35 49.53,46.35 49.53,48.9
AGND  (via drill 0.3 pad 0.5)
  other vias: 63.5,16.19 67.31,16.19
  pour Top (isolate 0.3): 65.72,40.64 63.5,40.64 63.5,20.64 60.64,20.64 60.64,15.56 71.44,15.56 71.44,40.64 63.5,40.64
  pour Bottom (isolate 0.3): 63.5,40.64 63.5,20.64 60.64,20.64 60.64,15.56 71.44,15.56 71.44,40.64
  pour Route2 (isolate 0.3): 63.5,40.64 63.5,20.64 60.64,20.64 60.64,15.56 71.44,15.56 71.44,40.64
  pour Route15 (isolate 0.3): 63.5,40.64 63.5,20.64 60.64,20.64 60.64,15.56 71.44,15.56 71.44,40.64
ANE
  Top 0.254: U1.37 24.66,34.5 36.51,46.35 TP9.TP S1.12
  Bottom 0.5: S1.12 R9.1
AVDD  (via drill 0.3 pad 0.5)
  Top 0.254: U1.36 27.54,32.28 v27.56,32.26
  Bottom 0.5: L1.2 29,31.93 C11.1 27.89,31.93 v27.56,32.26
COL  (via drill 0.3 pad 0.5)
  Top 0.254: v17.78,32.89 17.78,32.33 U1.1
  Top 0.7: X9.1 X10.1
  Bottom 0.254: X10.1 5.71,55.88 12.7,55.88 13.34,55.24 13.34,34.29 13.65,33.97 15.56,33.97 16.05,33.48 R33.2 16.83,32.7 17.02,32.89 v17.78,32.89
  Bottom 0.7: X9.1 X10.1
CRS  (via drill 0.3 pad 0.5)
  Top 0.254: X9.18 X10.35 5.71,15.24 11.43,15.24 11.75,15.56 11.75,18.1 12.06,18.41 23.81,18.41 24.16,18.76 U1.23 24.19,25.38 24.19,26.48 24.39,26.67 v24.45,26.67
  Bottom 0.254: X9.18 X10.35 | v24.45,26.67 26.04,26.67 26.67,26.04 R35.1
DUPLEX
  Top 0.254: U1.38 24.16,35.08 33.97,44.9 TP10.TP S1.11
  Bottom 0.5: S1.11 R10.1
FPGA_+3.3V  (via drill 0.3 pad 0.5)
  Top 0.5: R32.2 61.88,39.34 61.28,38.73 v58.74,38.73
  Top 0.7: R32.2 61.88,44.1 X4.3
  Top 1: X9.15 X10.29 | X3.2 X4.3
  Route15 0.254: X10.29 5.71,22.86 11.43,22.86
  Route15 0.5: v58.74,38.73 41.59,38.73 40.64,37.78 13.97,37.78 13.34,37.15 13.34,23.81 12.38,22.86 11.43,22.86
  Bottom 1: X9.15 X10.29 | X3.2 X4.3
FPGA_+5V  (via drill 0.3 pad 0.5)
  Top 0.5: v55.56,51.44 61.28,51.44 61.91,52.07 61.91,53.69
  Top 0.7: 61.91,53.69 R31.2 61.88,56.48 X2.3
  Top 1: X9.6 X10.11 | X1.2 X2.3
  Route15 0.254: X10.11 5.71,45.72 5.71,50.48 6.03,50.8 11.43,50.8
  Route15 0.5: 11.43,50.8 12.7,50.8 14.29,52.39 44.13,52.39 45.09,51.44 v55.56,51.44
  Bottom 1: X9.6 X10.11 | X2.3 X1.2
GND  (via drill 0.3 pad 0.5)
  Top 0.254: v24.77,31.75 24.79,31.78 U1.35 | v19.05,27.81 19.05,27.62 18.7,27.28 U1.11 | U1.17 21.16,23.06 20.95,22.86 v20.95,21.72 | U1.45 20.66,31.75 | 20.66,31.75 20.66,30.18 v20.64,30.16 | U1.29 24.97,28.78 v24.77,28.57 | 20.66,31.75 19.68,31.75 18.69,32.74 18.69,33.01 17.73,33.97 v16.83,33.97
  Top 0.5: v14.29,2.54 15.84,2.54 R28.1 | v20.64,2.54 19.12,2.54 D8.C | v23.5,2.54 25.05,2.54 R24.1 | v29.84,2.54 28.33,2.54 D10.C | v32.7,2.54 34.26,2.54 R3.1 | v39.05,2.54 37.54,2.54 D2.C | v41.91,2.54 43.47,2.54 R16.1 | v48.26,2.54 46.74,2.54 D4.C | v51.12,2.54 52.67,2.54 R20.1 | v57.47,2.54 55.95,2.54 D6.C | v60.01,14.29 61.56,14.29 R36.1 | v63.82,14.29 65.33,14.29 C16.2 | v67.63,14.29 69.14,14.29 C21.2 | v58.1,60.88 C6.2 | v55.24,59.37 C3.2 | v58.1,49.21 C7.2 | v55.24,47.62 C5.2 | C8.2 48.58,45.09 | 48.58,45.09 v48.58,43.81 | v46.99,45.09 48.58,45.09 | C17.2 v37.15,39.37 | v37.15,20.64 C18.2 | v18.1,39.05 C2.2 | v22.86,39.05 C1.2 | S2.1 v14.92,54.29
  Top 1: X10.12 X11.6
  Bottom 1: X10.12 X11.6 | X10.30 X11.15
  other vias: 32.07,28.26 46.99,53.02 16.19,51.12 39.05,54.1 41.59,54.1 28.89,34.61 41.27,35.56 41.27,24.77 15.37,26.54 25.4,21.91 43.18,20.64 52.07,20.64 27.62,44.45 43.18,45.09 12.7,59.69 22.23,59.69 24.77,53.98 46.04,56.2 17.46,2.54 26.67,2.54 35.88,2.54 45.09,2.54 54.29,2.54 71.12,14.29 24.77,48.9 54.61,52.7
  pour Bottom (isolate 0.2, rank 2): 0,0 0,65 73,65 73,0
  pour Route2 (isolate 0.2, rank 2): 0,65 73,65 73,0 0,0
  pour Top (isolate 0.2, rank 2): 0,0 0,6.99 12.7,6.99 12.7,17.46 59.37,17.46 59.37,14.92 73,14.92 73,0
  pour Top (isolate 0.2, rank 2): 0,59.05 0,65 73,65 73,41.27 62.55,41.27 62.55,39.69 56.52,39.69 56.52,42.55 23.81,42.55 23.81,59.05
  pour Top (isolate 0.2, rank 2): 17.46,25.08 17.46,33.97 26.35,33.97 26.35,25.08
  pour Top (isolate 0.2, rank 2): 14.61,50.16 24.13,50.16 24.13,59.37 14.61,59.37
ISOLATE  (via drill 0.3 pad 0.5)
  Top 0.254: U1.43 21.66,34.99 v21.91,35.24 | S1.13 TP7.TP
  Bottom 0.254: v21.91,35.24 24.45,35.24 25.08,35.88 25.08,45.4 25.4,45.72 38.73,45.72 39.05,46.04 S1.13
  Bottom 0.5: S1.13 R8.2
LDPS
  Top 0.254: U1.41 22.66,35.99 28.89,42.23 TP12.TP S1.9
  Bottom 0.5: S1.9 R12.1
LED0  (via drill 0.3 pad 0.5)
  Top 0.254: U1.9 15.26,28.28 14.61,27.62 v14.61,22.48 | TP1.TP JP1.2
  Bottom 0.254: JP1.2 13.97,9.21 13.65,9.53 13.65,16.83 14.61,17.78 v14.61,22.48
LED1  (via drill 0.3 pad 0.5)
  Top 0.254: v15.88,22.48 15.88,24.77 16.19,25.08 16.19,27.3 16.66,27.78 U1.10 | TP2.TP JP2.2
  Bottom 0.254: JP2.2 TP2.TP 21.91,9.53 21.91,16.83 21.59,17.14 16.51,17.14 15.88,17.78 v15.88,22.48
LED2  (via drill 0.3 pad 0.5)
  Top 0.254: U1.12 17.14,26.78 v17.14,22.48 | TP3.TP JP3.2
  Bottom 0.254: JP3.2 TP3.TP 31.11,9.53 31.11,17.46 30.8,17.78 17.78,17.78 17.14,18.41 v17.14,22.48
LED3  (via drill 0.3 pad 0.5)
  Top 0.254: U1.13 19.16,24.55 18.41,23.81 v18.41,22.48 | TP4.TP JP4.2
  Bottom 0.254: JP4.2 TP4.TP 40.32,9.53 40.32,18.1 40.01,18.41 19.05,18.41 18.41,19.05 v18.41,22.48
LED4  (via drill 0.3 pad 0.5)
  Top 0.254: U1.15 20.16,23.97 19.37,23.18 v19.36,22.48 | TP5.TP JP5.2
  Bottom 0.254: JP5.2 TP5.TP 49.53,9.53 49.53,18.73 49.21,19.05 20,19.05 19.37,19.68 v19.36,22.48
MDC  (via drill 0.3 pad 0.5)
  Top 0.254: R47.2 26.99,23.81 27.3,24.13 27.3,25.08 | 27.3,25.08 27.3,26.35 26.88,26.78 U1.25 | v28.26,25.08 27.3,25.08
  Bottom 0.254: X6.1 v28.26,25.08
MDC_0R  (via drill 0.3 pad 0.5)
  Top 0.254: R47.1 v26.99,20.89
  Top 0.7: X10.24 X11.12
  Bottom 0.254: v26.99,20.89 22.61,20.89 22.23,21.27 22.23,23.81 21.91,24.13 12.7,24.13 12.38,24.45 12.38,28.89 12.06,29.21 X11.12
  Bottom 0.7: X10.24 X11.12
MDIO
  Top 0.254: U1.26 29.06,27.28 R5.2 29.35,23.96 R48.2 30.51,23.78 31.75,22.54 X6.2
MDIO_0R  (via drill 0.3 pad 0.5)
  Top 0.254: R48.1 29.59,21.88 v29.59,20.83
  Top 0.7: X10.26 X11.13
  Bottom 0.254: v29.59,20.83 29.59,20.07 29.21,19.68 21.08,19.68 20.19,20.57 20.19,23.24 19.94,23.5 12.06,23.5 11.75,23.81 11.75,26.35 11.43,26.67 X11.13
  Bottom 0.7: X10.26 X11.13
MII/SNIB/TXD5
  Top 0.254: U1.44 21.16,35.76 26.35,40.96 TP13.TP S1.8
  Bottom 0.5: R13.1 S1.8
N$1  (via drill 0.3 pad 0.5)
  Top 0.254: U1.28 27.92,28.28 v27.94,28.26
  Bottom 0.254: v27.94,28.26 R6.2
N$2
  Top 0.5: D1.C R2.1
N$3
  Top 0.35: R2.2 34.58,10.51 34.29,10.79 JP3.3
  Top 0.5: R1.2 JP3.3
N$4
  Top 0.5: R4.1 D2.A
N$5
  Top 0.35: R4.2 34.58,7.9 34.29,7.62 JP3.1
  Top 0.5: R3.2 JP3.1
N$6
  Top 0.7: JP6.1 55.23,44.51 C5.1 58.05,44.53 C7.1 58.1,41.91 58.74,41.27 R32.1
N$7
  Top 0.7: X11.16 X10.32
  Bottom 0.7: X10.32 X11.16
N$8
  Top 0.5: D3.C R15.1
N$9
  Top 0.35: R15.2 43.78,10.51 43.5,10.79 JP4.3
  Top 0.5: R14.2 JP4.3
N$10
  Top 0.5: R17.1 D4.A
N$11
  Top 0.35: R17.2 43.78,7.9 43.5,7.62 JP4.1
  Top 0.5: R16.2 JP4.1
N$12
  Top 0.5: D5.C R19.1
N$13
  Top 0.35: R19.2 52.99,10.51 52.7,10.79 JP5.3
  Top 0.5: JP5.3 R18.2
N$14
  Top 0.5: R21.1 D6.A
N$15
  Top 0.35: R21.2 52.99,7.9 52.7,7.62 JP5.1
  Top 0.5: R20.2 JP5.1
N$16
  Top 0.5: D9.C R23.1
N$17
  Top 0.35: R23.2 25.37,10.51 25.08,10.79 JP2.3
  Top 0.5: R22.2 JP2.3
N$18
  Top 0.35: R25.2 25.37,7.9 25.08,7.62 JP2.1
  Top 0.5: R24.2 JP2.1
N$19
  Top 0.5: R25.1 D10.A
N$20
  Top 0.5: D7.C R27.1
N$21
  Top 0.35: R27.2 16.16,10.51 15.88,10.79 JP1.3
  Top 0.5: JP1.3 R26.2
N$22
  Top 0.5: R29.1 D8.A
N$23
  Top 0.35: R29.2 16.16,7.9 15.88,7.62 JP1.1
  Top 0.5: R28.2 JP1.1
N$24
  Top 0.7: R31.1 58.74,53.66 58.1,54.29 C6.1 58.05,56.27 C3.1 52.76,56.27 U2.3
N$25
  Top 0.7: JP6.3 52.07,52.39 51.44,53.02 C4.1 50.16,53.1 U2.2
  pour Top (isolate 0.3, no thermals): 49.21,54.93 49.21,57.47 46.35,57.47 46.35,63.5 53.98,63.5 53.98,57.47 51.12,57.47 51.12,54.93
N$26
  Top 0.7: X11.17 X10.34
  Bottom 0.7: X10.34 X11.17
N$27
  Top 0.7: X11.18 X10.36
  Bottom 0.7: X10.36 X11.18
N$28
  Top 0.7: X10.38 X11.19
  Bottom 0.7: X10.38 X11.19
N$29
  Top 0.7: X10.40 X11.20
  Bottom 0.7: X10.40 X11.20
N$31
  Bottom 0.254: X7.5 58.74,32.07 | R46.2 57.47,31.75 57.78,32.07 58.74,32.07 | X7.4 58.74,32.07
N$32
  Top 0.4: R38.1 C17.1
  Top 0.5: R37.1 37.35,36.48 C17.1
N$33
  Top 0.4: R39.1 C18.1
  Top 0.5: R40.1 37.35,23.85 C18.1
N$34  (via drill 0.3 pad 0.5)
  Top 0.254: U3.10 v54.93,26.99
  Bottom 0.254: v54.93,26.99 R43.2
N$35  (via drill 0.3 pad 0.5)
  Top 0.254: U3.15 v49.85,33.34
  Bottom 0.254: v49.85,33.34 54.61,33.34 54.93,33.02 R44.2
N$36
  Bottom 0.254: R45.2 62.51,24.73 62.87,25.08 62.87,35.56 62.55,35.88 61.28,35.88 | X7.8 61.28,35.88 | X7.7 61.28,35.88
N$37
  Bottom 0.254: R45.1 R46.1 R43.1 54.9,22.86 53.02,22.86 52.7,23.18 52.7,29.53 53.06,29.88 R44.1
  Bottom 0.5: C22.1 R46.1
N$44
  Top 0.7: X9.7 X10.13
  Bottom 0.7: X9.7 X10.13
N$45
  Top 0.7: X9.8 X10.15
  Bottom 0.7: X10.15 X9.8
N$53
  Top 0.7: X9.16 X10.31
  Bottom 0.7: X9.16 X10.31
N$56
  Top 0.7: X9.19 X10.37
  Bottom 0.7: X10.37 X9.19
N$57
  Top 0.7: X9.20 X10.39
  Bottom 0.7: X10.39 X9.20
N$58
  Top 0.7: X10.2 X11.1
  Bottom 0.7: X10.2 X11.1
N$59
  Top 0.7: X11.2 X10.4
  Bottom 0.7: X10.4 X11.2
N$60
  Top 0.7: X10.6 X11.3
  Bottom 0.7: X10.6 X11.3
N$61
  Top 0.7: X10.8 X11.4
  Bottom 0.7: X10.8 X11.4
N$62
  Top 0.7: X10.10 X11.5
  Bottom 0.7: X10.10 X11.5
N$64
  Top 0.7: X10.14 X11.7
  Bottom 0.7: X10.14 X11.7
N$65
  Top 0.7: X10.16 X11.8
  Bottom 0.7: X11.8 X10.16
N$66
  Top 0.7: X10.18 X11.9
  Bottom 0.7: X11.9 X10.18
PHY_RST  (via drill 0.3 pad 0.5)
  Top 0.254: U1.42 22.16,32.58 v22.35,32.38 | v20.64,54.29 S2.2 19.53,55.53 19.18,55.88 12.38,55.88 12.06,55.56 v12.06,54.61
  Top 0.7: X11.14 X10.28
  Bottom 0.254: v22.35,32.38 22.35,32.89 20.64,34.61 20.64,39.69 22.23,41.27 22.23,50.16 21.27,51.12 C15.1 19.29,54.29 | 19.29,54.29 19.29,57.11 R30.1 | 19.29,54.29 v20.64,54.29 | X10.28 5.71,25.4 5.71,53.02 6.03,53.34 11.75,53.34 12.06,53.66 v12.06,54.61
  Bottom 0.5: TP6.TP R30.1
  Bottom 0.7: X10.28 X11.14
PWFBIN  (via drill 0.3 pad 0.5)
  Top 0.254: U1.8 19,28.78 v19.05,28.83
  Bottom 0.254: L2.2 15.11,29.17 C12.1 15.44,28.83 v19.05,28.83
PWFBOUT  (via drill 0.3 pad 0.5)
  Top 0.254: U1.32 23.7,30.28 23.5,30.48 v23.5,31.11
  Bottom 0.254: R41.2 36.51,31.43 36.2,31.11 36.2,30.09 | 36.2,30.09 36.2,29.21 36.51,28.89 R42.2 | 36.2,30.09 C13.1 v23.5,31.11 21.14,31.11 C14.1 18.92,31.62 17.78,30.48 L2.1
RDCT  (via drill 0.3 pad 0.5)
  Top 0.4: U3.7 v41.27,26.99
  Bottom 0.4: v41.27,26.99 39.77,26.99 C19.1 39.65,26.94 R42.1
RPTR/RTT2  (via drill 0.3 pad 0.5)
  Top 0.254: U1.40 23.16,32.61 23.39,32.38 v23.81,32.38 | S1.14 TP8.TP
  Bottom 0.254: S1.14 41.59,43.5 41.27,43.18 27.94,43.18 27.62,42.86 27.62,34.61 26.99,33.97 24.13,33.97 23.81,33.66 v23.81,32.38
  Bottom 0.5: S1.14 R7.2
RX_N
  Top 0.21: U3.9 56.83,25.72 arc90 57.17,26.05 57.17,26.36 arc90 56.91,26.62 56.38,26.62 arc-90 56.11,26.89 56.11,27.19 arc-90 56.38,27.45 56.91,27.45 arc90 57.17,27.72 57.17,28.02 arc90 56.91,28.29 56.38,28.29 arc-90 56.11,28.55 56.11,28.85 arc-90 56.38,29.12 56.91,29.12 arc90 57.17,29.38 57.17,29.69 arc90 56.91,29.95 56.38,29.95 arc-90 56.11,30.21 56.11,30.52 arc-90 56.38,30.78 56.91,30.78 arc90 57.17,31.05 57.17,31.35 arc90 56.91,31.61 arc-90 56.48,32.04 arc-90 56.96,32.51 57.91,32.51 X7.6
RX_P
  Top 0.21: U3.11 50.16,28.26 49.85,27.94 49.85,25.4 50.16,25.08 59.37,25.08 60.01,25.72 60.01,27.62 61.28,28.89 X7.3
RXC
  Top 0.21: X10.21 5.71,30.48 11.11,30.48 13.65,27.94 13.65,22.23 14.29,21.59 19.68,21.59 20.32,22.23 20.32,23.18 20.66,23.52 U1.16
  Top 0.7: X9.11 X10.21
  Bottom 0.7: X9.11 X10.21
RXD0
  Top 0.21: X10.33 5.71,17.78 5.71,20 6.03,20.32 11.75,20.32 13.02,19.05 22.23,19.05 23.16,19.98 U1.21
  Top 0.7: X9.17 X10.33
  Bottom 0.7: X9.17 X10.33
RXD1
  Top 0.21: X10.27 5.71,22.86 11.43,22.86 11.75,22.54 11.75,21.27 13.34,19.68 21.91,19.68 22.66,20.43 U1.20
  Top 0.7: X9.14 X10.27
  Bottom 0.7: X9.14 X10.27
RXD2
  Top 0.21: X10.25 5.71,25.4 12.06,25.4 12.38,25.08 12.38,21.59 13.65,20.32 21.59,20.32 22.16,20.89 U1.19
  Top 0.7: X9.13 X10.25
  Bottom 0.7: X9.13 X10.25
RXD3
  Top 0.21: X10.23 5.71,27.94 12.7,27.94 13.02,27.62 13.02,21.91 13.97,20.95 21.27,20.95 21.66,21.34 U1.18
  Top 0.7: X9.12 X10.23
  Bottom 0.7: X9.12 X10.23
RXDV  (via drill 0.3 pad 0.5)
  Top 0.254: U1.22 23.66,27.14 23.3,27.5 19.88,27.5 v18.1,25.72
  Top 0.7: X10.20 X11.10
  Bottom 0.254: X11.10 10.16,34.29 13.65,30.8 13.65,26.04 14.03,25.65 18.03,25.65 v18.1,25.72
  Bottom 0.7: X10.20 X11.10
RXER  (via drill 0.3 pad 0.5)
  Top 0.254: v25.72,24.77 25.72,25.08 25.45,25.35 U1.24
  Top 0.7: X10.22 X11.11
  Bottom 0.254: X11.11 11.43,31.75 13.02,30.16 13.02,25.08 13.34,24.77 24.13,24.77 | 24.13,24.77 v25.72,24.77 | R34.1 24.13,24.77
  Bottom 0.7: X10.22 X11.11
SPEED
  Top 0.254: U1.39 23.66,35.72 31.43,43.5 TP11.TP S1.10
  Bottom 0.5: S1.10 R11.1
TDCT  (via drill 0.3 pad 0.5)
  Top 0.4: U3.2 v41.27,33.34
  Bottom 0.4: v41.27,33.34 39.77,33.34 C20.1 39.65,33.38 R41.1
TPRX_N
  Top 0.21: U3.8 39.72,25.72 | U1.30 27.24,29.28 27.3,29.21 33.66,29.21 35.56,27.3 39.37,27.3 39.69,26.99 R40.2
  Top 0.4: 39.72,25.72 R40.2
TPRX_P
  Top 0.21: U1.31 34.04,29.78 35.56,28.26 37.11,28.26 R39.2 | R39.2 arc-90 37.18,28.26 | U3.6 41.59,28.26 arc-90 41.33,28.52 arc90 41.06,28.79 40.82,28.79 arc90 40.55,28.52 40.55,28.31 arc-90 40.29,28.05 40.04,28.05 arc-90 39.77,28.31 39.77,28.52 arc90 39.51,28.79 39.26,28.79 arc90 39,28.52 arc-90 38.73,28.26 37.18,28.26 | 37.18,28.26 arc90 R39.2
  Top 0.4: 37.18,28.26 R39.2
TPTX_N
  Top 0.21: U1.33 26.11,30.8 33.97,30.8 35.28,32.1 R38.2 arc90 37.18,32.07 38.73,32.07 arc-90 39,31.8 39,31.75 arc90 39.26,31.49 39.51,31.49 arc90 39.77,31.75 39.77,32.06 arc-90 40.04,32.33 40.29,32.33 arc-90 40.55,32.06 40.55,31.75 arc90 40.82,31.49 41.06,31.49 arc90 41.33,31.75 41.33,31.8 arc-90 41.59,32.07 U3.3
  Top 0.4: R38.2 37.18,32.07
TPTX_P
  Top 0.21: U3.1 39.72,34.61 39.72,33.37 39.37,33.02 35.24,33.02 33.66,31.43 27.3,31.43 27.15,31.28 U1.34
  Top 0.4: 39.72,34.61 R37.2
TX_N
  Top 0.21: U3.14 54.93,32.07 arc90 55.24,32.38 arc90 54.98,32.65 54.28,32.65 arc-90 54.01,32.91 54.01,33.06 arc-90 54.28,33.32 54.98,33.32 arc90 55.24,33.58 55.24,33.73 arc90 54.98,33.99 54.28,33.99 arc-90 54.01,34.25 54.01,34.4 arc-90 54.28,34.66 54.98,34.66 arc90 55.24,34.92 55.24,35.24 arc-90 55.56,35.56 55.69,35.56 arc-90 56.01,35.24 56.01,34.62 56.01,34.61 56.01,33.95 arc90 56.24,33.72 56.43,33.72 arc90 56.7,33.98 56.7,34.09 arc-90 57.28,34.67 59.5,34.67 60.01,34.16 60.01,29.21 59.05,28.26 X7.2
TX_P
  Top 0.21: X7.1 62.55,26.99 62.87,27.3 62.87,36.2 61.91,37.15 52.39,37.15 51.88,36.64 U3.16
TXC
  Top 0.21: U1.7 13.9,29.28 12.38,30.8 12.38,32.7 12.06,33.02 5.71,33.02 X10.19
  Top 0.7: X10.19 X9.10
  Bottom 0.7: X9.10 X10.19
TXD0
  Top 0.21: U1.6 14.36,29.78 13.02,31.11 13.02,34.61 12.06,35.56 5.71,35.56 X10.17
  Top 0.7: X9.9 X10.17
  Bottom 0.7: X9.9 X10.17
TXD1
  Top 0.21: X10.9 5.71,45.72 11.43,45.72 11.75,45.4 11.75,36.83 13.65,34.92 13.65,31.43 14.81,30.28 U1.5
  Top 0.7: X9.5 X10.9
  Bottom 0.7: X9.5 X10.9
TXD2
  Top 0.21: X10.7 5.71,48.26 12.06,48.26 12.38,47.94 12.38,37.15 14.29,35.24 14.29,31.75 15.26,30.78 U1.4
  Top 0.7: X9.4 X10.7
  Bottom 0.7: X9.4 X10.7
TXD3
  Top 0.21: X10.5 5.71,50.8 12.7,50.8 13.02,50.48 13.02,37.47 14.92,35.56 14.92,32.07 15.71,31.28 U1.3
  Top 0.7: X9.3 X10.5
  Bottom 0.7: X9.3 X10.5
TXEN
  Top 0.254: U1.2 16.16,31.78 15.56,32.38 15.56,35.88 13.65,37.78 13.65,53.02 13.34,53.34 5.71,53.34 X10.3
  Top 0.7: X9.2 X10.3
  Bottom 0.7: X9.2 X10.3
X1
  Top 0.21: U1.46 20.16,35.24 arc90 19.84,35.56 arc-90 19.52,35.88 19.52,36.09 arc-90 19.84,36.41 20.48,36.41 arc90 20.79,36.72 20.79,36.94 arc90 20.48,37.25 19.84,37.25 arc-90 19.52,37.57 19.52,37.78 arc-90 19.84,38.1 arc90 20.16,38.42 20.16,39.03 C1.1 20.18,42.82 XT1.1
  Bottom 0.5: XT1.1 20.22,47.52 X5.3
X2
  Top 0.21: U1.47 19.66,34.83 18.41,36.07 18.41,36.83 17.46,37.78 15.88,37.78 15.42,38.24 C2.1 15.42,42.78 XT1.2
  Bottom 0.5: X5.1 15.34,47.52 XT1.2

### Text on the board
tNames: Ethernet Breakout-Board / Simon Dorrer, JKU ISP | MII | LDPS | SPEED | DUPLEX | ANE | ISOLATE | RPTR | RST | FPGA-CON | LED0 | LED1 | LED2 | LED3 | LED4 | 06.2023
bNames: GND | Ethernet Breakout-Board / Simon Dorrer, JKU ISP / 06.2023 | <9V | GND | 3.3V | FPGA-CON